# EAGLE design Spatium B Model Uydu PCB newline_2021 (EAGLE 9.6.2)
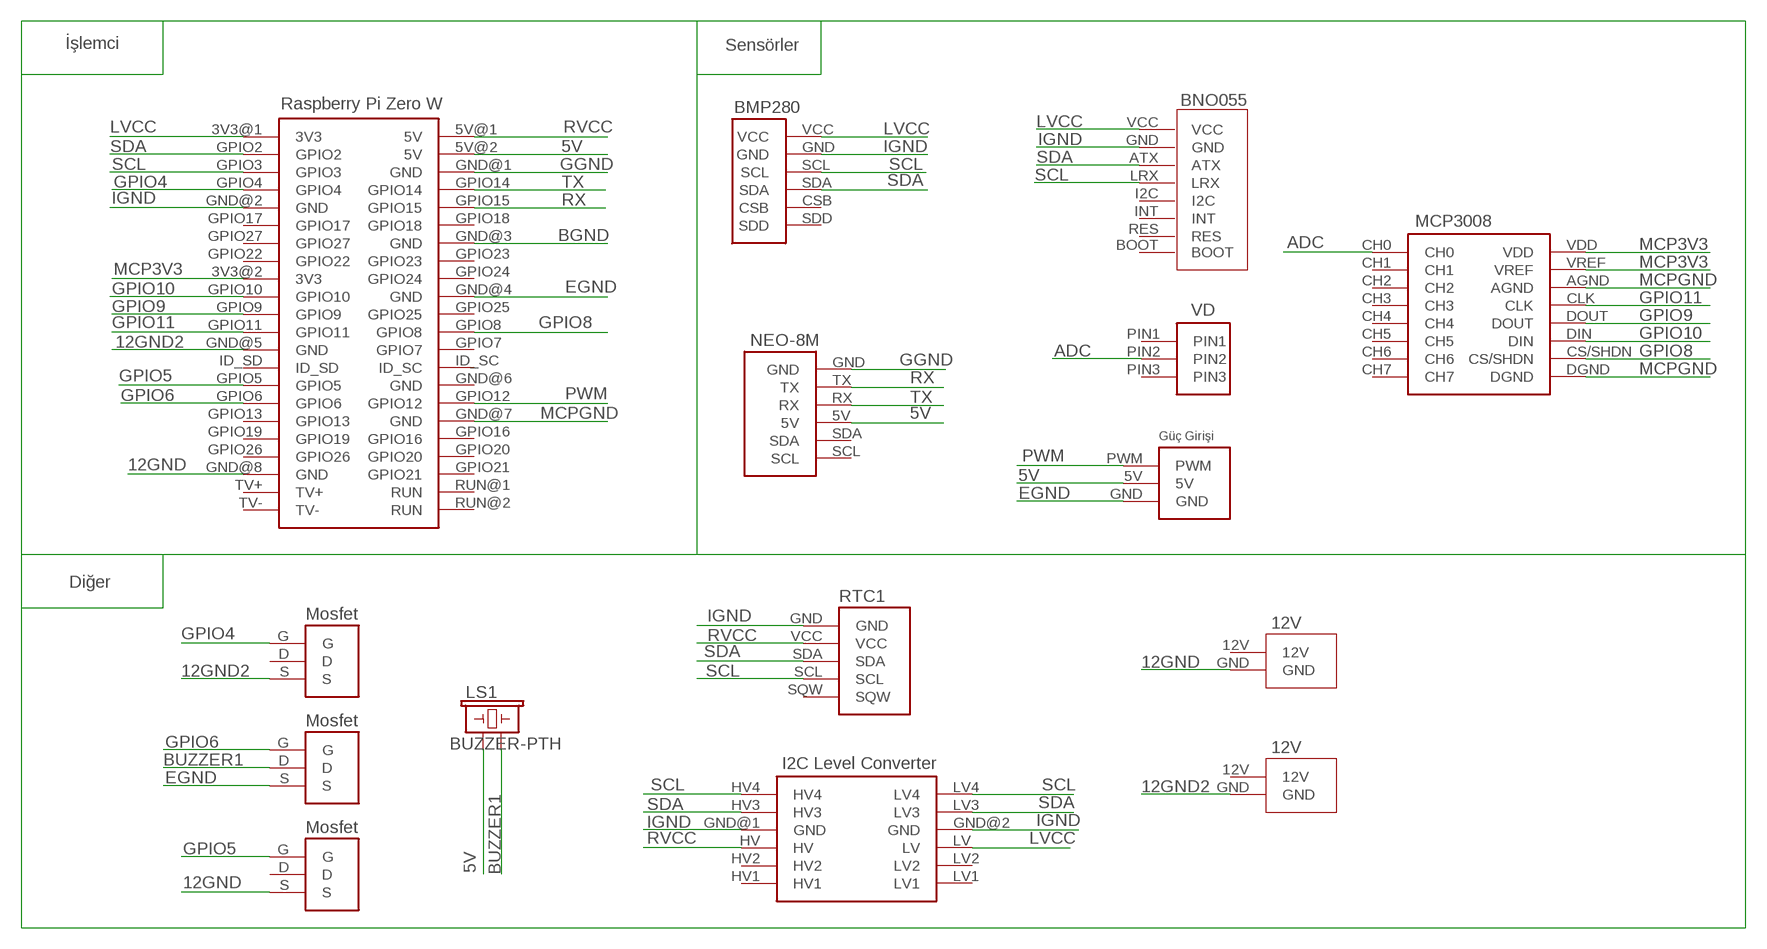
[diagram p0: schematic, sheet 1]

## Parts
BNO1  BNO055  [BNO055]
LS1  BUZZER-PTH  [BUZZER-12MM]
RTC1  PCF8523_RTC  [PCF8523_RTC]
U$1  RASPBERRY_ZERO_W  [RASPBERRY_ZERO_W]
U$2  BMP280  [BMP280]
U$3  I2C_LOGIC_LEVEL_CONVERTER  [I2C_LOGIC_LEVEL_CONVERTER]
U$4  NEOM8N  [NEO8M]
U$5  VOLTAGE_DIVIDER  [VOLTAGE_DIVIDER]
U$6  MOSFET  [MOSFET]
U$7  Güç_GIRIS  [Güç_GIRIS]
U$8  MOSFET  [MOSFET]
U$9  MOSFET  [MOSFET]
U$10  12V  [12V]
U$11  12V  [12V]
U$12  MCP3008  [MCP3008]

## Nets
5V: LS1.+ U$1.5V@2(5V) U$4.5V U$7.5V
12GND: U$1.GND@8(GND) U$6.S U$10.GND
12GND2: U$1.GND@5(GND) U$9.S U$11.GND
ADC: U$5.PIN2 U$12.CH0
BGND: U$1.GND@3(GND)
BUZZER1: LS1.- U$8.D
EGND: U$1.GND@4(GND) U$7.GND U$8.S
GGND: U$1.GND@1(GND) U$4.GND
GPIO4: U$1.GPIO4 U$9.G
GPIO5: U$1.GPIO5 U$6.G
GPIO6: U$1.GPIO6 U$8.G
GPIO8: U$1.GPIO8 U$12.CS/SHDN
GPIO9: U$1.GPIO9 U$12.DOUT
GPIO10: U$1.GPIO10 U$12.DIN
GPIO11: U$1.GPIO11 U$12.CLK
IGND: BNO1.GND RTC1.GND U$1.GND@2(GND) U$2.GND U$3.GND@1(GND) U$3.GND@2(GND)
LVCC: BNO1.VCC U$1.3V3@1(3V3) U$2.VCC U$3.LV
MCP3V3: U$1.3V3@2(3V3) U$12.VDD U$12.VREF
MCPGND: U$1.GND@7(GND) U$12.AGND U$12.DGND
PWM: U$1.GPIO12 U$7.PWM
RVCC: RTC1.VCC U$1.5V@1(5V) U$3.HV
RX: U$1.GPIO15 U$4.TX
SCL: BNO1.LRX RTC1.SCL U$1.GPIO3 U$2.SCL U$3.HV4 U$3.LV4
SDA: BNO1.ATX RTC1.SDA U$1.GPIO2 U$2.SDA U$3.HV3 U$3.LV3
TX: U$1.GPIO14 U$4.RX
Unconnected: BNO1.BOOT BNO1.I2C BNO1.INT BNO1.RES RTC1.SQW U$1.GND@6(GND) U$1.GPIO7 U$1.GPIO13 U$1.GPIO16 U$1.GPIO17 U$1.GPIO18 U$1.GPIO19 U$1.GPIO20 U$1.GPIO21 U$1.GPIO22 U$1.GPIO23 U$1.GPIO24 U$1.GPIO25 U$1.GPIO26 U$1.GPIO27 U$1.ID_SC U$1.ID_SD U$1.RUN@1(RUN) U$1.RUN@2(RUN) U$1.TV+ U$1.TV- U$2.CSB U$2.SDD U$3.HV1 U$3.HV2 U$3.LV1 U$3.LV2 U$4.SCL U$4.SDA U$5.PIN1 U$5.PIN3 U$6.D U$9.D U$10.12V U$11.12V U$12.CH1 U$12.CH2 U$12.CH3 U$12.CH4 U$12.CH5 U$12.CH6 U$12.CH7

## Notes on the sheet
- İşlemci | Sensörler
- Diğer

## Library data of the parts
BNO1 = RPiZeroW:BNO055
LS1 = SparkFun-Electromechanical:BUZZER: Buzzer Small round buzzers that operate around the audible 2kHz range. You can use these as speakers to create simple music or user interfaces. Variant Overview: PTH - Mini Speaker - PC Mount 12mm 2.048kHz <https://www.sparkfun.com/products/7950> PTH_KIT - Mini Speaker - PC Mount 12mm 2.048kHz <https://www.sparkfun.com/products/7950> KIT simplifies soldering by adding stop mask to one side of the pads. PTH_NO_SILK - Mini Speaker - PC Mount 12mm 2.048kHz <https://www.sparkfun.com/products/7950> No silkscreen indicator of buzzer outline. PTH_KIT_NO_SILK - Mini Speaker - PC Mount 12mm 2.048kHz <https://www.sparkfun.com/products/7950> KIT package w/o silkscreen SMD - Buzzer Audio Magnetic (CCV-084B16) SMD buzzer used on, e.g. the LilyPad Buzzer <https://www.sparkfun.com/products/8463> and RFID USB Reader <https://www.sparkfun.com/products/9963>. SMD_KIT - Buzzer Audio Magnetic (CCV-084B16) SMD Buzzer with elongated pins to make soldering easier. Used on the SparkFun Simon Says - Surface Mount Soldering Kit <https://www.sparkfun.com/products/10935>.; PROD_ID: COMP-08253; SF_SKU: COM-07950
RTC1 = RPiZeroW:PCF8523_RTC
U$1 = RPiZeroW:RASPBERRY_ZERO_W
U$2 = RPiZeroW:BMP280
U$3 = RPiZeroW:I2C_LOGIC_LEVEL_CONVERTER
U$4 = RPiZeroW:NEOM8N
U$5 = RPiZeroW:VOLTAGE_DIVIDER
U$6 U$8 U$9 = RPiZeroW:MOSFET
U$7 = RPiZeroW:Güç_GIRIS
U$10 U$11 = RPiZeroW:12V
U$12 = SpatiumB:MCP3008

## Board
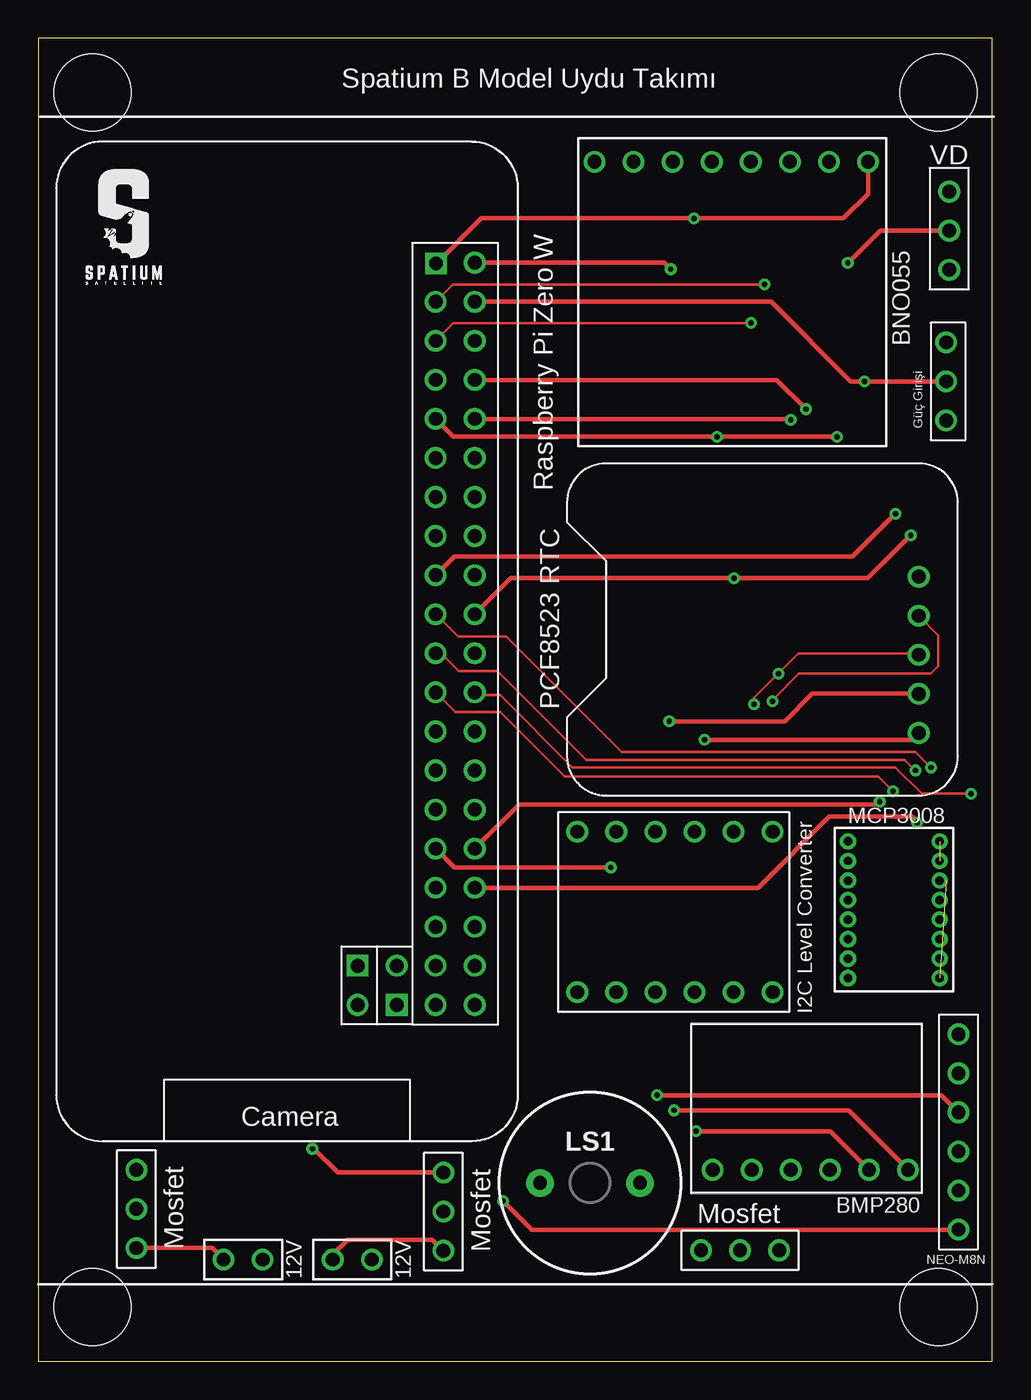
[diagram p1: board, top side]
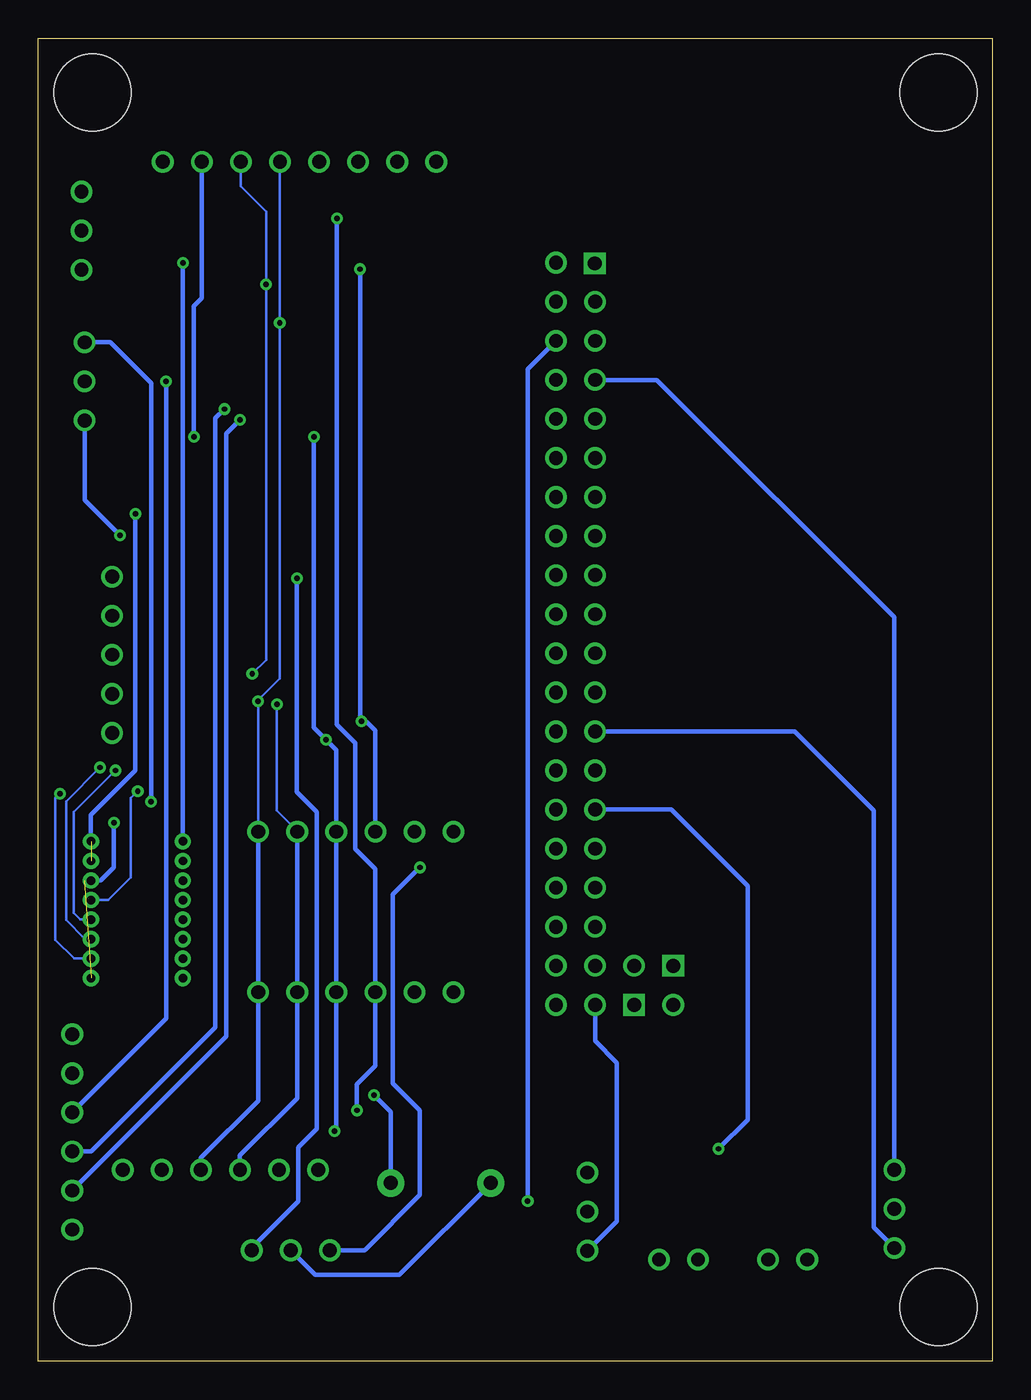
[diagram p2: board, bottom side, seen from below]

Size 62 x 86 mm. Coordinates in mm from the lower left corner, seen from the top.
Outline: 0,0 62,0 62,86 0,86 0,0
Copper layers (1*16): Top 0.035mm / dielectric 1.5mm / Bottom 0.035mm
Design rules "default": minimum track width 6mil, minimum drill 0.35mm, track to track 6mil, track to pad 6mil, pad to pad 6mil, via to via 6mil, smd to smd 6mil, copper to edge 40mil, drill to drill 6mil, minimum pad ring 10mil, minimum via ring 8mil, stop-mask expansion 4mil, vias tented up to drill 0mil, thermal gap 10mil
Holes 5 mm at 58.5,3.5 3.5,3.5 3.5,82.5 58.5,82.5

### Footprints (pad centres in the part's own frame; a part is rotated, then mirrored left to right if it is on the bottom)
BNO055 = drill 0.9: ATX -8.48,3.74; BOOT -8.48,-8.96; GND -8.48,6.28; I2C -8.48,-1.34; INT -8.48,-3.88; LRX -8.48,1.2; RES -8.48,-6.42; VCC -8.48,8.82
BUZZER-12MM = drill 0.9 pad 1.778: + 3.25,0; - -3.25,0
PCF8523_RTC = drill 0.9: GND -6.858,-10.414; SCL 0.762,-10.414; SDA -1.778,-10.414; SQW 3.302,-10.414; VCC -4.318,-10.414
RASPBERRY_ZERO_W = drill 0.9 square: 3V3@1 -24.079,9.685; RUN@2 24.13,7.128; TV+ 21.59,4.588 | drill 0.9: 3V3@2 -3.81,9.66; 5V@1 -24.13,12.2; 5V@2 -21.59,12.2; GND@1 -19.05,12.2; GND@2 -13.97,9.66; GND@3 -8.89,12.2; GND@4 -1.27,12.2; GND@5 6.35,9.66; GND@6 11.43,12.2; GND@7 16.51,12.2; GND@8 24.13,9.66; GPIO2 -21.59,9.66; GPIO3 -19.05,9.66; GPIO4 -16.51,9.66; GPIO5 11.43,9.66; GPIO6 13.97,9.66; GPIO7 6.35,12.2; GPIO8 3.81,12.2; GPIO9 1.27,9.66; GPIO10 -1.27,9.66; GPIO11 3.81,9.66; GPIO12 13.97,12.2; GPIO13 16.51,9.66; GPIO14 -16.51,12.2; GPIO15 -13.97,12.2; GPIO16 19.05,12.2; GPIO17 -11.43,9.66; GPIO18 -11.43,12.2; GPIO19 19.05,9.66; GPIO20 21.59,12.2; GPIO21 24.13,12.2; GPIO22 -6.35,9.66; GPIO23 -6.35,12.2; GPIO24 -3.81,12.2; GPIO25 1.27,12.2; GPIO26 21.59,9.66; GPIO27 -8.89,9.66; ID_SC 8.89,12.2; ID_SD 8.89,9.66; RUN@1 21.59,7.128; TV- 24.13,4.588
BMP280 = drill 0.9: CSB 3.81,3.81; GND -3.81,3.81; SCL -1.27,3.81; SDA 1.27,3.81; SDD 6.35,3.81; VCC -6.35,3.81
I2C_LOGIC_LEVEL_CONVERTER = drill 0.9: GND@1 -5.12,1.74; GND@2 5.31,1.74; HV -5.12,-0.8; HV1 -5.12,-5.88; HV2 -5.12,-3.34; HV3 -5.12,4.28; HV4 -5.12,6.82; LV 5.31,-0.8; LV1 5.31,-5.88; LV2 5.31,-3.34; LV3 5.31,4.28; LV4 5.31,6.82
NEO8M = drill 0.9: 5V 0,-1.27; GND 0,6.35; RX 0,1.27; SCL 0,-6.35; SDA 0,-3.81; TX 0,3.81
VOLTAGE_DIVIDER = drill 0.9: PIN1 0,2.54; PIN2 0,0; PIN3 0,-2.54
MOSFET = drill 0.9: D 0,0; G -2.54,0; S 2.54,0
Güç_GIRIS = drill 0.9: 5V 0,0; GND -2.54,0; PWM 2.54,0
12V = drill 0.9: 12V 0,1.27; GND 0,-1.27
MCP3008 = drill 0.55: AGND 2.978,1.85; CH0 -2.986,4.39; CH1 -2.986,3.12; CH2 -2.986,1.85; CH3 -2.986,0.58; CH4 -2.986,-0.69; CH5 -2.986,-1.96; CH6 -2.986,-3.23; CH7 -2.986,-4.5; CLK 2.978,0.58; CS/SHDN 2.978,-3.23; DGND 2.978,-4.5; DIN 2.978,-1.96; DOUT 2.978,-0.69; VDD 2.978,4.39; VREF 2.978,3.12

### Placement (x,y rotation side)
BNO1  45.1,69.5 270 top
LS1  35.85,11.58 0 top
RTC1  46.8,47.7 90 top
U$1  16.16,47.29 270 top
U$2  50.17,16.24 180 top
U$3  40.9,29.3 270 top
U$4  59.8,14.9 180 top
U$5  59.2,73.5 0 top
U$6  26.32,9.72 270 top
U$7  59,63.7 90 top
U$8  45.6,7.2 0 top
U$9  6.36,9.89 270 top
U$10  20.4,6.6 270 top
U$11  13.3,6.6 270 top
U$12  55.6,29.4 0 top

### Tracks (layer width: path | path; a pad name or v marks a point on that pad's centre or on a via)
5V  (via drill 0.35)
  Top 0.305: U$1.5V@2 47.62,68.88 52.8,63.7 v53.7,63.7 U$7.5V | v40.2,17.3 40.5,17.3 40.52,17.28 58.69,17.28 U$4.5V
  Bottom 0.152: 59.74,16.04 59.74,16.11 59.77,16.14 U$4.5V | 39.17,11.54 LS1.+ | 58.98,63.81 U$7.5V
  Bottom 0.305: v53.7,63.7 53.7,22.27 U$4.5V | LS1.+ 39.1,16.2 v40.2,17.3
12GND
  Top 0.305: U$10.GND 19.13,6.93 20.1,7.9 25.6,7.9 U$6.S
  Bottom 0.305: U$1.GND@8 25.82,20.82 24.4,19.4 24.4,9.1 U$6.S
12GND2
  Top 0.305: U$9.S 11.28,7.35 U$11.GND
  Bottom 0.305: U$1.GND@5 12.84,40.94 7.7,35.8 7.7,8.69 U$9.S
ADC  (via drill 0.35)
  Top 0.152: 52.73,33.79 U$12.CH0 | 59.28,73.41 U$5.PIN2
  Top 0.305: v52.6,71.4 54.7,73.5 U$5.PIN2
  Bottom 0.305: U$12.CH0 52.61,71.39 v52.6,71.4
BUZZER1
  Bottom 0.152: 32.61,11.54 LS1.-
  Bottom 0.305: U$8.D 44,5.6 38.55,5.6 32.61,11.54
EGND  (via drill 0.35)
  Top 0.152: 58.98,61.07 U$7.GND
  Top 0.305: U$1.GND@4 30.7,50.9 v45.2,50.9 53.9,50.9 v56.7,53.7
  Bottom 0.305: v56.7,53.7 59,56 U$7.GND | v45.2,50.9 45.2,37 43.9,35.7 43.9,15.1 45.1,13.9 45.1,10.4 48.14,7.36 U$8.S
GGND  (via drill 0.35)
  Top 0.305: U$4.GND 32.05,8.55 v30.2,10.4
  Bottom 0.305: v30.2,10.4 30.2,64.5 U$1.GND@1
GPIO4
  Bottom 0.305: U$9.G 6.36,48.36 21.8,63.8 U$1.GPIO4
GPIO5  (via drill 0.35)
  Top 0.305: U$6.G 19.44,12.26 17.9,13.8 v17.8,13.8
  Bottom 0.305: v17.8,13.8 15.9,15.7 15.9,30.9 20.86,35.86 U$1.GPIO5
GPIO6  (via drill 0.35)
  Top 0.152: 42.98,7.27 U$8.G
  Top 0.305: U$1.GPIO6 27.04,32.1 v37.2,32.1
  Bottom 0.305: v37.2,32.1 38.97,30.33 38.97,18.07 37.2,16.3 37.2,10.8 40.8,7.2 U$8.G
GPIO8  (via drill 0.35)
  Top 0.152: 58.37,26.32 58.52,26.32 U$12.CS/SHDN 58.18,26.17 | 28.76,43.89 U$1.GPIO8 28.36,43.3 30,43.3 34.7,38.6 55.7,38.6 57.4,36.9 v60.61,36.9
  Bottom 0.152: U$12.CS/SHDN 59.68,26.17 60.91,27.4 60.91,36.6 v60.61,36.9
GPIO9  (via drill 0.35)
  Top 0.152: U$1.GPIO9 26.45,45.73 27.32,44.86 29.84,44.86 35.6,39.1 56.3,39.1 v57,38.4
  Bottom 0.152: U$12.DOUT 59.28,28.71 59.7,29.13 59.7,35.7 v57,38.4
GPIO10  (via drill 0.35)
  Top 0.152: 58.37,27.54 58.52,27.54 U$12.DIN | U$1.GPIO10 27.28,47.1 30.4,47.1 37.9,39.6 57.01,39.6 v58.01,38.6
  Bottom 0.152: v58.01,38.6 60.21,36.4 60.21,28.67 58.98,27.44 U$12.DIN
GPIO11  (via drill 0.35)
  Top 0.152: U$1.GPIO11 27.1,42.2 30,42.2 34.2,38 54.6,38 v55.55,37.05
  Bottom 0.152: U$12.CLK 57.48,29.98 56,31.46 56,36.6 v55.55,37.05
IGND  (via drill 0.35)
  Top 0.152: 42.67,24.03 U$3.GND@2 42.67,23.88 | 42.67,34.4 U$3.GND@1 | 53.83,12.3 53.95,12.3 U$2.GND
  Top 0.305: v43.3,40.4 56.77,40.4 RTC1.GND | U$1.GND@2 26.98,60.1 v44.1,60.1 v51.9,60.1 | v42.75,14.95 51.46,14.95 U$2.GND
  Bottom 0.152: 57.15,40.8 RTC1.GND | 42.67,34.4 U$3.GND@1 42.52,34.4
  Bottom 0.305: 42.52,34.4 42.64,34.28 U$3.GND@2 42.64,15.14 42.6,15.1 v42.75,14.95 | U$3.GND@1 42.64,39.74 v43.3,40.4 44.1,41.2 v44.1,60.1 | BNO1.GND 51.4,77.96 51.4,69.1 51.9,68.6 v51.9,60.1
LVCC  (via drill 0.35)
  Top 0.305: U$1.3V3@1 28.77,74.3 v42.6,74.3 52.3,74.3 53.92,75.92 BNO1.VCC | v41.3,16.3 52.65,16.3 U$2.VCC
  Bottom 0.305: v42.6,74.3 42.6,41.4 41.4,40.2 41.4,33.3 40.1,32 U$3.LV 40.1,19.2 41.3,18 v41.3,16.3
MCP3V3  (via drill 0.35)  (1 unrouted)
  Top 0.305: v55.7,55.1 52.9,52.3 27.02,52.3 U$1.3V3@2
  Bottom 0.305: U$12.VDD 58.6,33.81 58.6,35.5 55.7,38.4 v55.7,55.1
MCPGND  (via drill 0.35)  (1 unrouted)
  Top 0.152: 59.02,31.25 U$12.AGND
  Top 0.305: U$1.GND@7 46.78,30.78 51.4,35.4 56.8,35.4 57.1,35.1 v57.1,35
  Bottom 0.305: v57.1,35 57.1,32.1 57.95,31.25 U$12.AGND
PWM  (via drill 0.35)
  Top 0.152: 58.98,66.1 U$7.PWM
  Top 0.305: U$1.GPIO12 31.24,36.2 54.5,36.2 54.66,36.36 v54.68,36.36
  Bottom 0.305: v54.68,36.36 54.68,63.58 57.34,66.24 U$7.PWM
RVCC  (via drill 0.35)
  Top 0.305: v41,41.6 48.5,41.6 50.3,43.4 57.2,43.4 RTC1.VCC | U$1.5V@1 40.68,71.42 v41.1,71
  Bottom 0.305: U$3.HV 40.1,41 40.7,41.6 v41,41.6 41.1,41.7 v41.1,71
RX  (via drill 0.35)
  Top 0.305: U$1.GPIO15 48.84,61.26 v48.9,61.2
  Bottom 0.305: v48.9,61.2 49.8,60.3 49.8,21.1 U$4.TX
SCL  (via drill 0.35)
  Top 0.152: 47.7,24.03 U$3.LV4 47.85,23.88 47.72,24.01 | 47.7,34.4 U$3.HV4 | 51.36,12.45 U$2.SCL | v47.72,42.89 47.72,42.99 49.43,44.7 58,44.7 58.5,45.2 58.5,47.18 RTC1.SCL | U$1.GPIO3 26.98,67.5 v46.32,67.5
  Bottom 0.152: U$3.HV4 v47.72,42.89 47.72,42.99 46.32,44.39 v46.32,67.5 46.32,77.96 BNO1.LRX
  Bottom 0.305: U$3.HV4 U$3.LV4 47.72,16.92 51.44,13.2 U$2.SCL
SDA  (via drill 0.35)
  Top 0.152: 45.26,24.03 45.24,24.02 | 45.24,24.02 U$3.LV3 45.26,23.88 | 45.26,34.4 U$3.HV3 | 48.77,12.45 U$2.SDA | RTC1.SDA 57.14,46 49.4,46 v48.1,44.7 46.5,43.1 v46.5,42.7 | U$3.LV3 45.19,23.97 45.24,24.02 | U$1.GPIO2 26.94,70 v47.2,70
  Bottom 0.152: 48.77,77.83 BNO1.ATX 48.84,76.38 47.2,74.74 v47.2,70 47.2,45.6 v48.1,44.7 | v46.5,42.7 46.5,35.8 45.18,34.48 U$3.HV3
  Bottom 0.305: U$3.HV3 U$3.LV3 45.18,17.09 48.9,13.37 U$2.SDA
TX  (via drill 0.35)
  Top 0.305: U$1.GPIO14 48,63.8 v49.9,61.9
  Bottom 0.305: U$4.RX 58.57,13.63 50.5,21.7 50.5,61.3 v49.9,61.9

### Text on the board
tNames: Spatium B Model Uydu Takımı